# Altium schematic sheet SheetBYB2A.SchDoc
size 594 x 420 mm; Scale: 1:1; DocumentType: Схема электрическая принципиальная; FirstReferrence: АБВГ.123456.001
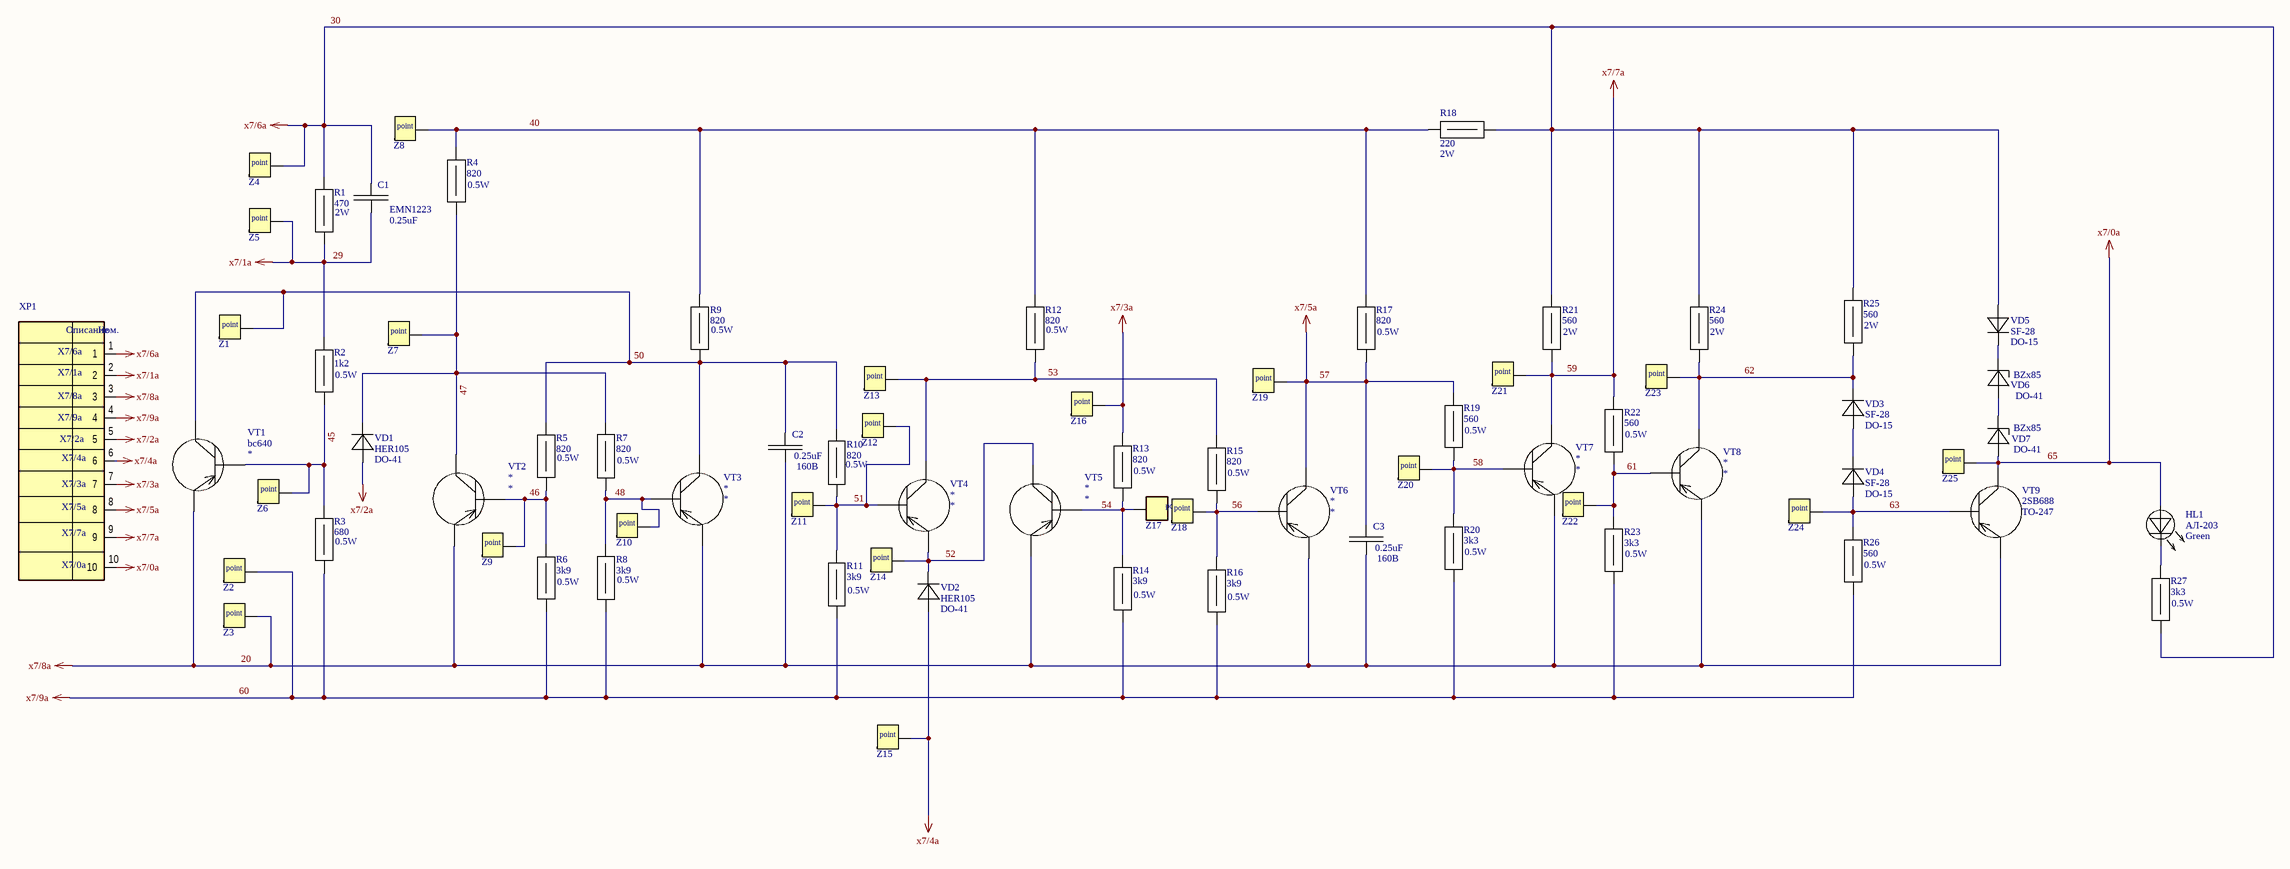
[diagram p0: SheetBYB2A.SchDoc]

## Parts
C1  value 0.25uF  Marka: EMN1223  [Capasitor]  (hidden comment: Capasitor)
C2  value 0.25uF  Voltage: 160B  [Capasitor]  (hidden comment: Capasitor)
C3  value 0.25uF  Voltage: 160B  [Capasitor]  (hidden comment: Capasitor)
HL1  Marka: АЛ-203  Color: Green  [GNLR]  (hidden comment: Led)
R1  value 470  Power: 2W  [Resistor_2W]  (hidden comment: Resistor_1/2W)
R2  value 1k2  Power: 0.5W  [RESC5025L]  (hidden comment: Resistor_1/2W)
R3  value 680  Power: 0.5W  [RESC5025L]  (hidden comment: Resistor_1/2W)
R4  value 820  Power: 0.5W  [RESC5025L]  (hidden comment: Resistor_1/2W)
R5  value 820  Power: 0.5W  [RESC5025L]  (hidden comment: Resistor_1/2W)
R6  value 3k9  Power: 0.5W  [RESC5025L]  (hidden comment: Resistor_1/2W)
R7  value 820  Power: 0.5W  [RESC5025L]  (hidden comment: Resistor_1/2W)
R8  value 3k9  Power: 0.5W  [RESC5025L]  (hidden comment: Resistor_1/2W)
R9  value 820  Power: 0.5W  [RESC5025L]  (hidden comment: Resistor_1/2W)
R10  value 820  Power: 0.5W  [RESC5025L]  (hidden comment: Resistor_1/2W)
R11  value 3k9  Power: 0.5W  [RESC5025L]  (hidden comment: Resistor_1/2W)
R12  value 820  Power: 0.5W  [RESC5025L]  (hidden comment: Resistor_1/2W)
R13  value 820  power: 0.5W  [RESC5025L]  (hidden comment: Resistor_1/2W)
R14  value 3k9  Power: 0.5W  [RESC5025L]  (hidden comment: Resistor_1/2W)
R15  value 820  power: 0.5W  [RESC5025L]  (hidden comment: Resistor_1/2W)
R16  value 3k9  Power: 0.5W  [RESC5025L]  (hidden comment: Resistor_1/2W)
R17  value 820  power: 0.5W  [RESC5025L]  (hidden comment: Resistor_1/2W)
R18  value 220  power: 2W  [Resistor_2W]  (hidden comment: Resistor_1/2W)
R19  value 560  power: 0.5W  [RESC5025L]  (hidden comment: Resistor_1/2W)
R20  value 3k3  power: 0.5W  [RESC5025L]  (hidden comment: Resistor_1/2W)
R21  value 560  power: 2W  [Resistor_2W]  (hidden comment: Resistor_1/2W)
R22  value 560  power: 0.5W  [RESC5025L]  (hidden comment: Resistor_1/2W)
R23  value 3k3  power: 0.5W  [RESC5025L]  (hidden comment: Resistor_1/2W)
R24  value 560  power: 2W  [Resistor_2W]  (hidden comment: Resistor_1/2W)
R25  value 560  power: 2W  [Resistor_2W]  (hidden comment: Resistor_1/2W)
R26  value 560  power: 0.5W  [RESC5025L]  (hidden comment: Resistor_1/2W)
R27  value 3k3  Power: 0.5W  [RESC5025L]  (hidden comment: Resistor_1/2W)
VD1  Marka: HER105  Package: DO-41  [DO-41-vertical]  (hidden comment: Diode)
VD2  Marka: HER105  Package: DO-41  [DO-41-vertical]  (hidden comment: Diode)
VD3  Marka: SF-28  Package: DO-15  [DO-15-Vertical]  (hidden comment: Diode)
VD4  Marka: SF-28  Package: DO-15  [DO-15-Vertical]  (hidden comment: Diode)
VD5  Marka: SF-28  Package: DO-15  [DO-15-Vertical]  (hidden comment: Diode)
VD6  Marka: BZx85  Package: DO-41  [DO-41-vertical]  (hidden comment: stabilizater)
VD7  Marka: BZx85  Package: DO-41  [DO-41-vertical]  (hidden comment: stabilizater)
VT1  Marka: bc640  [TO-92]  (hidden comment: Bipolar Transistor)
VT2  Bipolar Transistor  [TO-92]  (value not drawn)
VT3  Bipolar Transistor  [TO-92]  (value not drawn)
VT4  Bipolar Transistor  [TO-92]  (value not drawn)
VT5  Bipolar Transistor  [TO-92]  (value not drawn)
VT6  Bipolar Transistor  [TO-92]  (value not drawn)
VT7  Bipolar Transistor  [TO-92]  (value not drawn)
VT8  Bipolar Transistor  [TO-92]  (value not drawn)
VT9  package: TO-247  [TO-247-3]  (hidden comment: 2sb688)
XP1  Connector  [Connector]  (value not drawn)
Z1  point_control  [point_control]  (value not drawn)
Z2  point_control  [point_control]  (value not drawn)
Z3  point_control  [point_control]  (value not drawn)
Z4  point_control  [point_control]  (value not drawn)
Z5  point_control  [point_control]  (value not drawn)
Z6  point_control  [point_control]  (value not drawn)
Z7  point_control  [point_control]  (value not drawn)
Z8  point_control  [point_control]  (value not drawn)
Z9  point_control  [point_control]  (value not drawn)
Z10  point_control  [point_control]  (value not drawn)
Z11  point_control  [point_control]  (value not drawn)
Z12  point_control  [point_control]  (value not drawn)
Z13  point_control  [point_control]  (value not drawn)
Z14  point_control  [point_control]  (value not drawn)
Z15  point_control  [point_control]  (value not drawn)
Z16  point_control  [point_control]  (value not drawn)
Z17  point_control  [point_control]  (value not drawn)
Z18  point_control  [point_control]  (value not drawn)
Z19  point_control  [point_control]  (value not drawn)
Z20  point_control  [point_control]  (value not drawn)
Z21  point_control  [point_control]  (value not drawn)
Z22  point_control  [point_control]  (value not drawn)
Z23  point_control  [point_control]  (value not drawn)
Z24  point_control  [point_control]  (value not drawn)
Z25  point_control  [point_control]  (value not drawn)

## Nets
20: C2.2 C3.2 VT1.1 VT2.1 VT3.1 VT5.1 VT6.1 VT7.1 VT8.1 VT9.3 XP1.3 Z3.1  [also labelled x7/8a]
29: C1.2 R1.1 R2.2 XP1.2 Z5.1  [also labelled x7/1a]
30: C1.1 R1.2 R18.1 R21.2 R24.2 R25.2 R27.1 VD5.1 XP1.1 Z4.1  [also labelled x7/6a]
57: C3.1 R17.1 R19.2 VT6.2 XP1.8 Z19.1  [also labelled x7/5a]
59: R21.1 R22.2 VT7.2 XP1.9 Z21.1  [also labelled x7/7a]
60: R3.1 R6.1 R8.1 R11.1 R14.1 R16.1 R20.1 R23.1 R26.1 XP1.4 Z2.1  [also labelled x7/9a]
65: HL1.1 VD7.1 VT9.2 XP1.10 Z25.1  [also labelled x7/0a]
x7/2a: VD1.1 XP1.5
x7/3a: R13.2 XP1.7 Z16.1
x7/4a: VD2.1 XP1.6 Z15.1
40: R4.2 R9.2 R12.2 R17.2 R18.2 Z8.1
45: R2.1 R3.2 VT1.3 Z6.1
46: R5.1 R6.2 VT2.3 Z9.1
47: R4.1 R7.2 VD1.2 VT2.2 Z7.1
48: R7.1 R8.2 VT3.3 Z10.1
50: C2.1 R5.2 R9.1 R10.2 VT1.2 VT3.2 Z1.1
51: R10.1 R11.2 VT4.3 Z11.1 Z12.1
52: VD2.2 VT4.1 VT5.2 Z14.1
53: R12.1 R15.2 VT4.2 Z13.1
56: R15.1 R16.2 VT6.3 Z18.1
58: R19.1 R20.2 VT7.3 Z20.1
61: R22.1 R23.2 VT8.3 Z22.1
62: R24.1 R25.1 VD3.2 VT8.2 Z23.1
63: R26.2 VD4.1 VT9.1 Z24.1
NetHL1_2: HL1.2 R27.2
NetR13_1: R13.1 R14.2 VT5.3 Z17.1
NetVD3_1: VD3.1 VD4.2
NetVD5_2: VD5.2 VD6.2
NetVD6_1: VD6.1 VD7.2

## Notes on the sheet
- Labels drawn without touching a wire or pin: 54
- Перв. примен.
- Справ. №
- Подп. и дата
- Инв. № дубл.
- Взам. инв. №
- Разраб.
- Изм.
- Лист
- № докум.
- Подп.
- Дата
- Лит.
- Масса
- Масштаб
- Пров.
- Т.контр.
- Листов
- Инв. № подл.
- Утв.
- Н.контр.
- 2.106-A2
- Копировал
- Формат А2
- (in symbol Connector) Описание; Ном.; X7/6a; X7/1a; X7/8a; X7/9a; X7/2a; X7/4a; X7/3a; X7/5a; X7/7a; X7/0a
- (in symbol point_control) point

## Library data of the parts
C2 C3 = Capasitor: Marka: ELM; Package: *
R1 = Resistor_1/2W: Marka: RES2010; Package: 5020
R4 = Resistor_1/2W: Marka: R5025; Package: 2010
R5 R7 = Resistor_1/2W: Marka: R5020; Package: 2010
R6 = Resistor_1/2W: Marka: RE5020; Package: 2010
R8-R12 = Resistor_1/2W: Marka: RES5020; Package: 2010
R13-R27 = Resistor_1/2W: Marka: R2010; Package: 5020
C1 = Capasitor: Package: *
HL1 = Led: Package: *
R2 R3 = Resistor_1/2W: Marka: *; Package: *
VT1-VT8 = Bipolar Transistor: Package: *
  VT2-VT8: Marka: *
VT9 = 2sb688: marka: 2SB688